# Altium schematic sheet LinearActuator_SCH.SchDoc
size 420 x 297 mm; Author: Ehsan Shaghaei; SheetNumber: 1; SheetTotal: 1
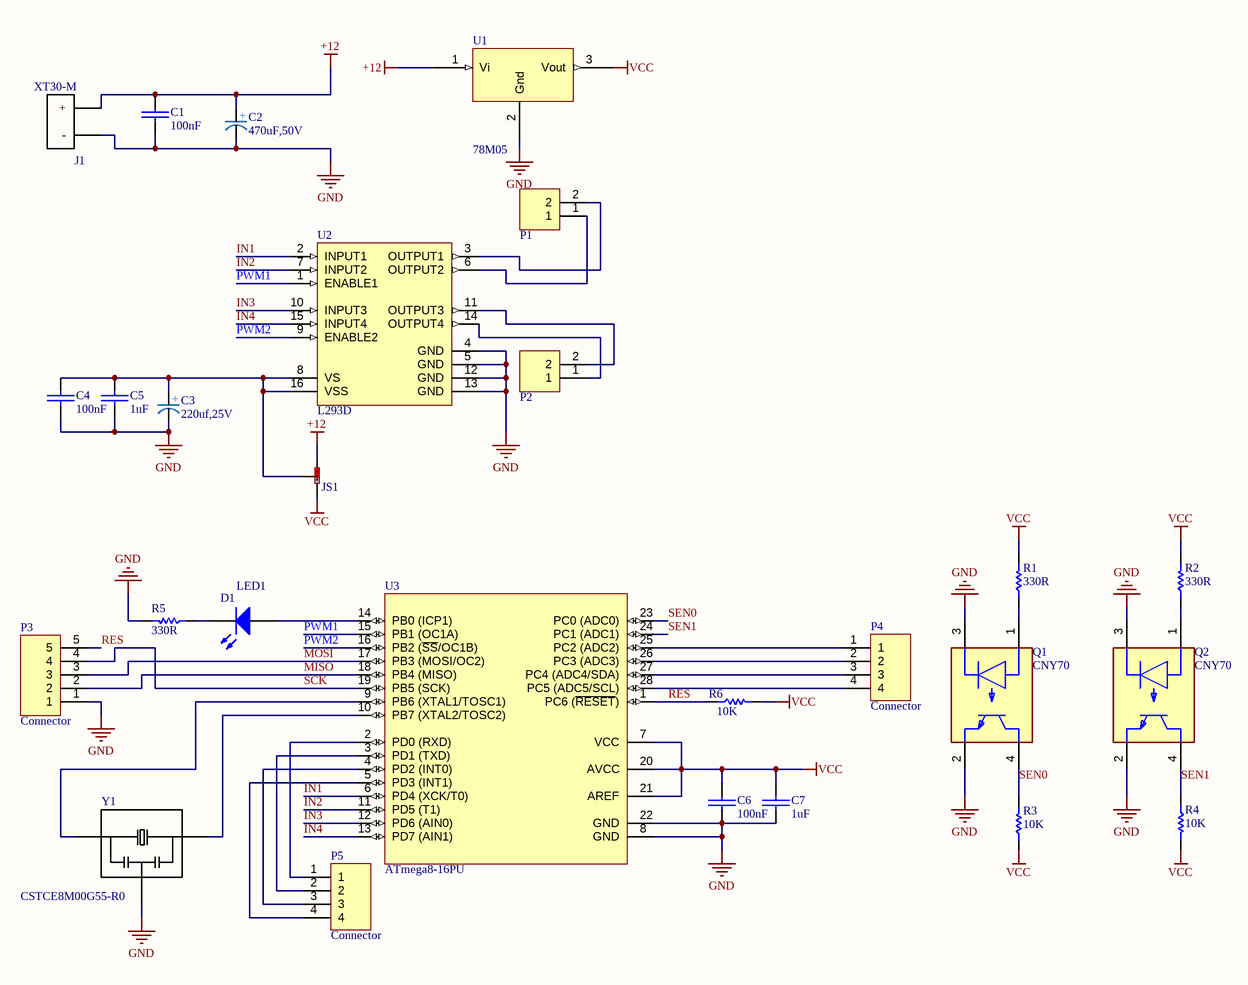
[diagram p0: LinearActuator_SCH.SchDoc]

## Parts
C1  100nF  [SMD_CAP_0603]
C2  470uF,50V  [CAPE R3.5]
C3  220uf,25V  [CAPE R3.5]
C4  100nF  [SMD_CAP_0603]
C5  1uF  [SMD_CAP_0603]
C6  100nF  [SMD_CAP_0603]
C7  1uF  [SMD_CAP_0603]
D1  LED1  [LED-1]
J1  XT30-M  [XT30-M side]
JS1  JumperSMD 3Pin  [JumperSMD 3Pin]  (value not drawn)
P1  Connector  [PH Connector 2Pin]  (value not drawn)
P2  Connector  [PH Connector 2Pin]  (value not drawn)
P3  Connector  [Polarized Header 5]
P4  Connector  [Polarized Header 4]
P5  Connector  [Polarized Header 4]
Q1  CNY70  [FP-6_544-5062_01-4-MFG]
Q2  CNY70  [FP-6_544-5062_01-4-MFG]
R1  330R  [Res-(1/4)]
R2  330R  [Res-(1/4)]
R3  10K  [Res-(1/4)]
R4  10K  [Res-(1/4)]
R5  330R  [Res-(1/4)]
R6  10K  [Res-(1/4)]
U1  78M05  [TO220-AB-Stand]
U2  L293D  [STM-L293D-16]
U3  ATmega8-16PU  [28P3]
Y1  CSTCE8M00G55-R0  [*OSC_CSTCE8M00G55-R0]

## Nets
+12: C1.1(+) C2.1 J1.PLUS(+) JS1.3 U1.1(Vi)
GND: C1.2(-) C2.2 C3.2 C4.2(-) C5.2(-) C6.2(-) C7.2(-) J1.MINUS(-) P3.1 Q1.2(E) Q1.3(C) Q2.2(E) Q2.3(C) R5.2 U1.2(Gnd) U2.4(GND) U2.5(GND) U2.12(GND) U2.13(GND) U3.8(GND) U3.22(GND) Y1.2
VCC: C6.1(+) C7.1(+) JS1.1 R1.2 R2.2 R3.1 R4.2 R6.2 U1.3(Vout) U3.7(VCC) U3.20(AVCC) U3.21(AREF)
IN1: U2.2(INPUT1) U3.6(PD4_(XCK/T0))
IN2: U2.7(INPUT2) U3.11(PD5_(T1))
IN3: U2.10(INPUT3) U3.12(PD6_(AIN0))
IN4: U2.15(INPUT4) U3.13(PD7_(AIN1))
MISO: P3.2 U3.18(PB4_(MISO))
MOSI: P3.3 U3.17(PB3_(MOSI/OC2))
PWM1: U2.1(ENABLE1) U3.15(PB1_(OC1A))
PWM2: U2.9(ENABLE2) U3.16(PB2_(~{SS}/OC1B))
RES: P3.5 R6.1 U3.1(PC6_(~{RESET}))
SCK: P3.4 U3.19(PB5_(SCK))
SEN0: Q1.4(C) R3.2 U3.23(PC0_(ADC0))
SEN1: Q2.4(C) R4.1 U3.24(PC1_(ADC1))
NetC3_1: C3.1 C4.1(+) C5.1(+) JS1.2 U2.8(VS) U2.16(VSS)
NetD1_1: D1.1(A) U3.14(PB0_(ICP1))
NetD1_2: D1.2(K) R5.1
NetP1_1: P1.1 U2.6(OUTPUT2)
NetP1_2: P1.2 U2.3(OUTPUT1)
NetP2_1: P2.1 U2.14(OUTPUT4)
NetP2_2: P2.2 U2.11(OUTPUT3)
NetP4_1: P4.1 U3.25(PC2_(ADC2))
NetP4_2: P4.2 U3.26(PC3_(ADC3))
NetP4_3: P4.3 U3.27(PC4_(ADC4/SDA))
NetP4_4: P4.4 U3.28(PC5_(ADC5/SCL))
NetP5_1: P5.1 U3.2(PD0_(RXD))
NetP5_2: P5.2 U3.3(PD1_(TXD))
NetP5_3: P5.3 U3.4(PD2_(INT0))
NetP5_4: P5.4 U3.5(PD3_(INT1))
NetQ1_1: Q1.1(A) R1.1
NetQ2_1: Q2.1(A) R2.1
NetU3_9: U3.9(PB6_(XTAL1/TOSC1)) Y1.1
NetU3_10: U3.10(PB7_(XTAL2/TOSC2)) Y1.3

## Notes on the sheet
- THIS DOCUMENT AND THE DATA DISCLOSED HEREIN OR
- HEREWITH IS THE PROPERTY OF ALTIUM LIMITED AND MAY
- DWG NO:
- REVISION
- REV:
- DESCRIPTION
- DATE
- APPROVED
- BE FREELY DISTRIBUTED IN WHOLE. NO RIGHTS ARE
- RESERVED OR EXPRESS OR IMPLIED WARANTEE GIVEN.
- ENG:
- APPROVALS
- PROJECT
- DSN:
- CHK:
- REFERENCE DOCUMENTS
- PROJECT REVISION:
- TITLE
- DOCUMENT REVISION:
- DESIGN ITEM:
- BOM:
- FAB DWG:
- PCB DWG:
- ASSY DWG:
- SCALE:
- A3
- SIZE
- CAGE CODE
- FILE NAME
- DWG NO.
- SHEET
- OF
- REV
- (in symbol Capacitor Polarized) +

## Library data of the parts
C1 C4-C7 = Cap-Bipolar: Bipolar Capacitor; Voltage: 100V; Designer: Saeid Jorablo; Organazation: ControTec; Adding Date: 1387/12/20
  C1 C4 C6: Value: 100nF
  C5 C7: Value: 1uF
C2 C3 = Capacitor Polarized: Designer: Hamed Jafarzadeh ( R2T )
D1 = LED1: Typical RED GaAs LED; Published: 8-Jun-2000; LatestRevisionDate: 08-Jul-2005; LatestRevisionNote: Mech Layer 1 removed.; PackageReference: LED-1; Publisher: Altium Limited; PackageDescription: LED; 2 Leads
J1 = XT30-M: MP: XT60-M; MF: AMASS; Package: Package Analog Devices; Availability: Unavailable; SnapEDA_Link: https://www.snapeda.com/parts/XT60-M/AMASS/view-part/?ref=snap; Price: None; Value: *
P1 P2 = Connector 2Pin: Designer:: Hamed Jafarzadeh - www.R2T.ir
P3 = Connector 5Pin: Designer:: Hamed Jafarzadeh - www.R2T.ir
P4 P5 = Connector 4Pin: Designer:: Hamed Jafarzadeh - www.R2T.ir
Q1 Q2 = CMP-02521-000007-1: SENSOR OPTO TRANS 5MM REFLTH PCB; Manufacturer: Vishay Semiconductor Opto Division; Power Dissipation: 200mW; Reverse Voltage: 5V; Wavelength: 940nm; Collector Emitter Voltage: 32V; Forward Current: 50mA; Max Junction Temp: +100°C; Forward Voltage: 1.25V; Emiiter Collector Voltage: 7V; Mouser Description: CNY70 Series 1 mA 1.25 V 950 nm 200 mW Reflective Optical Sensor 4 Pin; Category: Trans; RoHS: TRUE; Temperature: to +100°C; Lead Free: Yes; Temperature Range High: +100°C; Ambient Temperature Range High: +85°C; Manufacturer Part Number: CNY70; ComponentLink2URL: http://www.vishay.com/docs/83751/cny70.pdf; ComponentLink2Description: Datasheet; Octopart: https://octopart.com/cny70-vishay-39692873; Device Class L3: unset; Ambient Temperature Range Low: -40°C; Package: 6.544-5062.01-4; Device Class L1: Optoelectronics; Height: 6mm; Digikey Description: SENSOR OPTO TRANS 5MM REFLTH PCB; Automotive: No; Device Class L2: Optocouplers
R1-R6 = Resistor: Tolerance: 5%; Power: 1/8 W
  R1 R2 R5: Value: 330R
  R3 R4 R6: Value: 10K
U1 = Regulator
U2 = CMP-2000-06524-1: Push-Pull Four Channel Driver with Diode, 4.5 to 36 V, -40 to 150 degC, 16-Pin PDIP, RoHS, Tube; Manufacturer: STMicroelectronics; Number of Outputs: 4; Current - Peak Output: 1.2A; Current - Output / Channel: 600mA; Input Type: Non-Inverting; Other Related Documents: L293DViewAllSpecifications; Dynamic Catalog: HalfBridge; Voltage - Supply: 4.5V~36V; Other Names: 497-2936-5; Package / Case: 16-DIP(0.300",7.62mm); PartNumber: L293D; Operating Temperature: -40°C~150°C; Datasheet URL: http://www.st.com/st-web-ui/static/active/en/resource/technical/document/datasheet/CD00000059.pdf; Supplier Device Package: 16-PowerDIP; Packaging: Tube; Package Description: 16-Pin Thru-Hole Dual-In-Line, Body 20 x 6.85 mm, Pitch 2.54 mm; Standard Package: 25; Datasheet Version: 07/2003; On-State Resistance: -; Manufacturer URL: http://www.st.com/; Category: IntegratedCircuits(ICs); Family: PMIC-MOSFET,BridgeDrivers-InternalSwitch; Type: HalfBridge; Series: -; Mounting Technology: ThroughHole; Package Reference: DIP-16; Mounting Type: ThroughHole
U3 = CMP-0095-00372-1: 8-bit AVR Microcontroller, 4.5-5.5V, 16MHz, 8KB Flash, 512 Bytes EEPROM, 1KB SRAM, 28-pin PDIP, Industrial Grade (-40°C to 85°C); ComponentLink3URL: http://www.atmel.com/dyn/resources/prod_documents/2486S.pdf; ComponentLink3Description: ATmega8(L) Summary; PackageDescription: 28-lead (0.300"/7.62mm Wide) Plastic Dual Inline Package (PDIP); ComponentLink2Description: ATmega8(L); ComponentLink1URL: http://www.atmel.com/; PackageVersion: revB, Sep-2001; ComponentLink1Description: Manufacturer URL; ComponentLink2URL: http://www.atmel.com/dyn/resources/prod_documents/doc2486.pdf; PackageReference: 28P3; DatasheetVersion: revZ, Feb-2011
Y1 = CSTCE8M00G55-R0: Ceramic Resonator 8MHz ??0.5% _Tol_ ??0.2% _Stability_ 33pF 40Ohm 3-Pin CSMD T/R; MF: Murata; MP: CSTCE8M00G55-R0; Package: SMD-3 Murata; SnapEDA_Link: https://www.snapeda.com/parts/CSTCE8M00G55-R0/Murata%20Electronics%20North%20America/view-part/?ref=snap; Value: *; ChipDip_Link: https://www.chipdip.ru/product1/8001783721; HelpURL: https://www.murata.com/en-eu/api/pdfdownloadapi?cate=&partno=CSTCE8M00G55-R0; Type: SMD